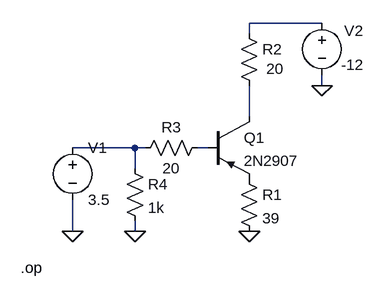
[diagram p0: schematic pnp1.asc]
pnp1.asc, the LTspice schematic file:
Version 4
SHEET 1 2428 680
WIRE 336 96 224 96
WIRE 224 112 224 96
WIRE 336 192 336 176
WIRE 224 240 224 192
WIRE 48 288 -48 288
WIRE 64 288 48 288
WIRE 160 288 144 288
WIRE 48 320 48 288
WIRE -48 416 -48 368
WIRE 48 416 48 400
FLAG 336 192 0
FLAG 224 416 0
FLAG -48 416 0
FLAG 48 416 0
SYMBOL res 32 304 R0
SYMATTR InstName R4
SYMATTR Value 1k
SYMBOL res 160 272 R90
WINDOW 0 0 56 VBottom 2
WINDOW 3 32 56 VTop 2
SYMATTR InstName R3
SYMATTR Value 20
SYMBOL res 208 96 R0
WINDOW 3 42 70 Left 2
SYMATTR Value 20
SYMATTR InstName R2
SYMBOL voltage -48 272 R0
WINDOW 123 0 0 Left 0
WINDOW 39 0 0 Left 0
SYMATTR InstName V1
SYMATTR Value 3.5
SYMBOL voltage 336 80 R0
WINDOW 0 34 28 Left 2
WINDOW 3 30 80 Left 2
WINDOW 123 0 0 Left 0
WINDOW 39 0 0 Left 0
SYMATTR InstName V2
SYMATTR Value -12
SYMBOL pnp 160 240 R0
SYMATTR InstName Q1
SYMATTR Value 2N2907
SYMBOL res 208 320 R0
SYMATTR InstName R1
SYMATTR Value 39
TEXT -128 472 Left 2 !.op

The netlist it stands for:
* pnp1.asc
R4 N003 0 1k
R3 N004 N003 20
R2 N001 N002 20
V1 N003 0 3.5
V2 N001 0 -12
Q1 N002 N004 P001 0 2N2907
R1 P001 0 39
.model NPN NPN
.model PNP PNP
.lib standard.bjt
.op
.backanno
.end